# Altium schematic sheet 12V_SUPPLY.SchDoc
size A2; SheetNumber: 2; SheetTotal: 3
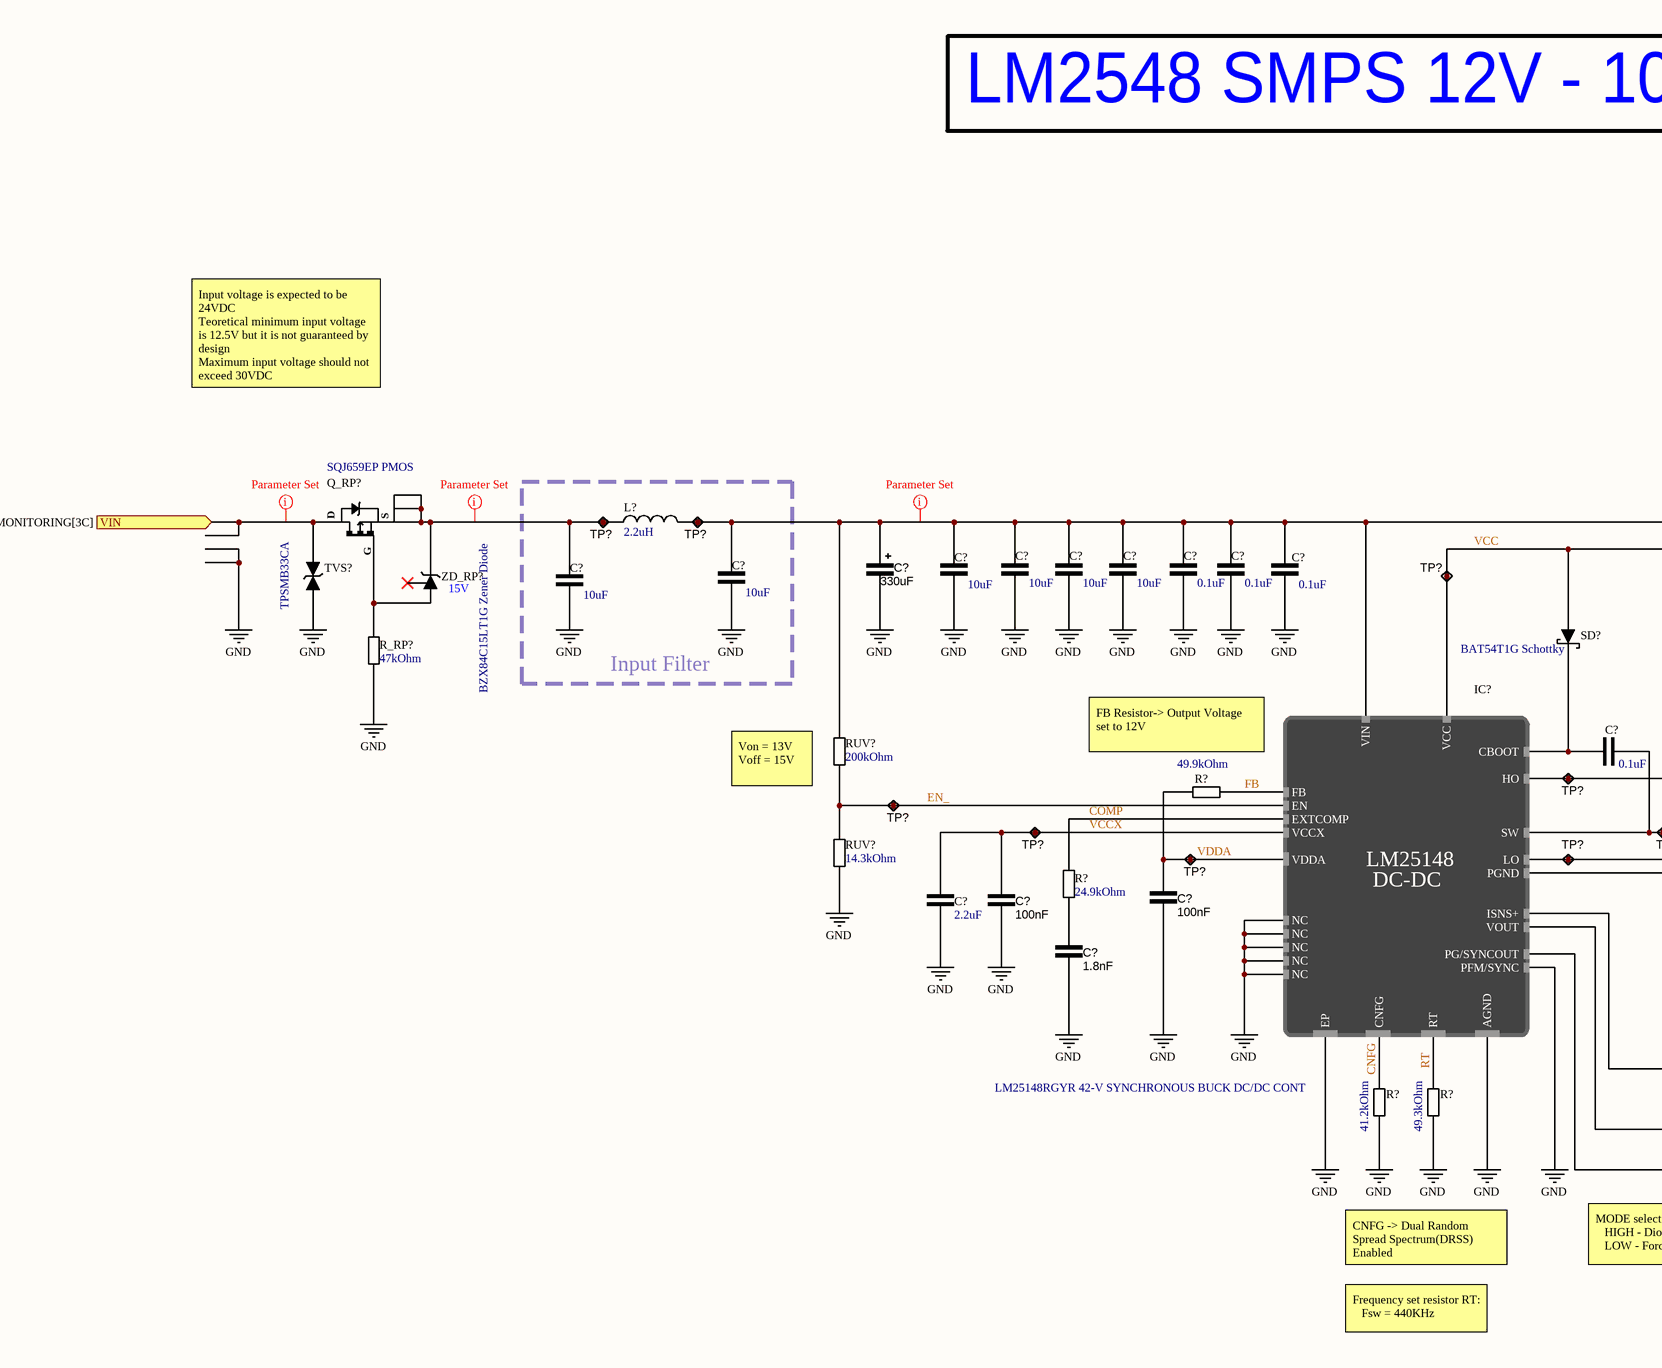
[diagram p0: 12V_SUPPLY.SchDoc, left]
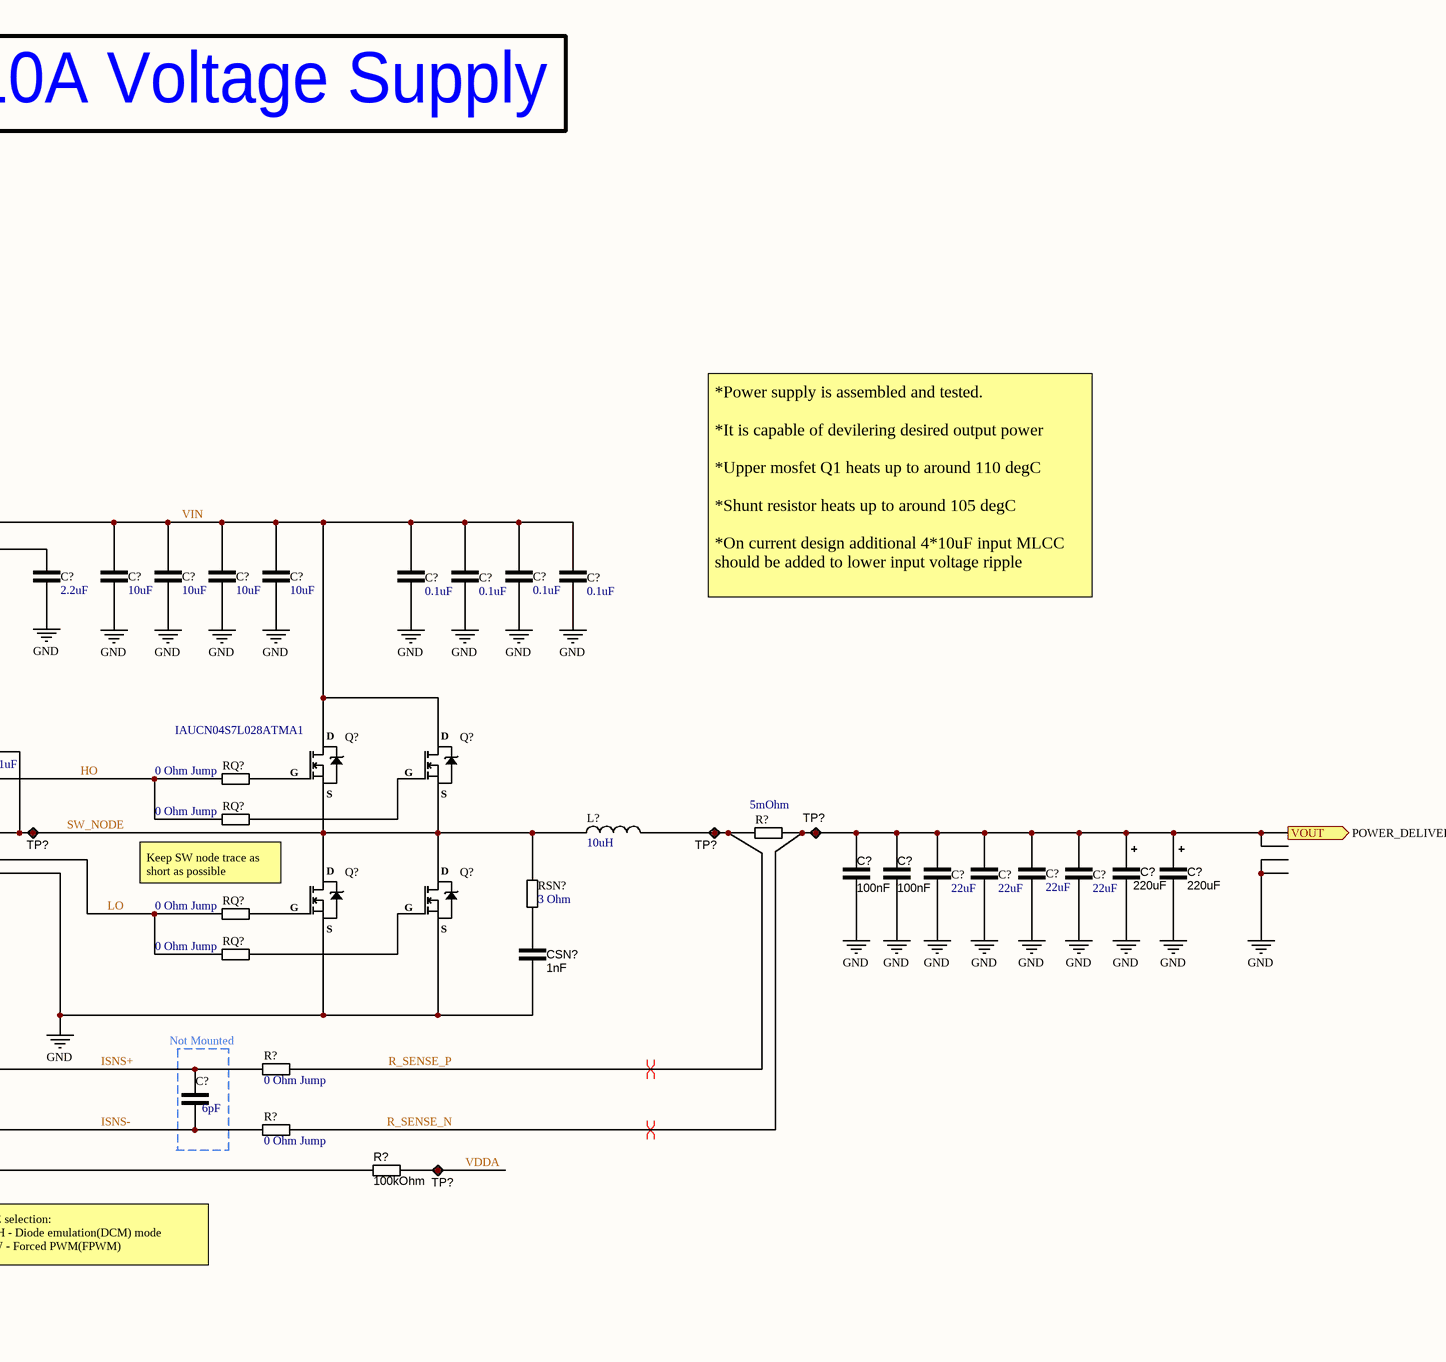
[diagram p1: 12V_SUPPLY.SchDoc, right]

## Parts
(Parts that share a designator on the sheet are numbered #1, #2 ... from top to bottom, then left to right.)
C?#1  330uF  [CAPAE109103X103M]
C?#2  10uF  [CAP_1206]
C?#3  10uF  [CAP_1206]
C?#4  10uF  [CAP_1206]
C?#5  10uF  [CAP_1206]
C?#6  0.1uF  [CAP_0603]
C?#7  0.1uF  [CAP_0603]
C?#8  0.1uF  [CAP_0603]
C?#9  10uF  [CAP_1206]
C?#10  2.2uF  [CAP_0603]
C?#11  10uF  [CAP_1206]
C?#12  10uF  [CAP_1206]
C?#13  10uF  [CAP_1206]
C?#14  10uF  [CAP_1206]
C?#15  0.1uF  [CAP_0603]
C?#16  0.1uF  [CAP_0603]
C?#17  0.1uF  [CAP_0603]
C?#18  0.1uF  [CAP_0603]
C?#19  10uF  [CAP_1206]
C?#20  0.1uF  [CAP_0603]
C?#21  100nF  [CAP_0603]
C?#22  100nF  [CAP_0603]
C?#23  22uF  [CAP_1210]
C?#24  22uF  [CAP_1210]
C?#25  22uF  [CAP_1210]
C?#26  22uF  [CAP_1210]
C?#27  220uF  [CAPAE109103X103M]
C?#28  220uF  [CAPAE109103X103M]
C?#29  2.2uF  [CAP_0603]
C?#30  100nF  [CAP_0603]
C?#31  100nF  [CAP_0603]
C?#32  1.8nF  [CAP_0603]
C?#33  6pF  [CAP_0402]
CSN?  1nF  [CAP_0805]
IC?  LM25148RGYR 42-V SYNCHRONOUS BUCK DC/DC CONT  [VQFN25_RGY_TEX]
L?#1  2.2uH  [IHLP-3232DZ-51]
L?#2  10uH  [INDP135126X65N]
Q?#1  IAUCN04S7L028ATMA1  [PG-TDSON-8-33]
Q?#2  IAUCN04S7L028ATMA1  [PG-TDSON-8-33]  (value not drawn)
Q?#3  IAUCN04S7L028ATMA1  [PG-TDSON-8-33]  (value not drawn)
Q?#4  IAUCN04S7L028ATMA1  [PG-TDSON-8-33]  (value not drawn)
Q_RP?  SQJ659EP PMOS  [PowerPAK SO-8L SINGLE]
R?#1  49.9kOhm  [RES_0603]
R?#2  5mOhm  [SENSE_RES_2512]
R?#3  24.9kOhm  [RES_0603]
R?#4  0 Ohm Jump  [RES_0402]
R?#5  41.2kOhm  [RES_0603]
R?#6  49.3kOhm  [RES_0603]
R?#7  0 Ohm Jump  [RES_0402]
R?#8  100kOhm  [RES_0603]
R_RP?  47kOhm  [RES_0603]
RQ?#1  0 Ohm Jump  [RES_0402]
RQ?#2  0 Ohm Jump  [RES_0402]
RQ?#3  0 Ohm Jump  [RES_0402]
RQ?#4  0 Ohm Jump  [RES_0402]
RSN?  3 Ohm  [RES_0805]
RUV?#1  200kOhm  [RES_0603]
RUV?#2  14.3kOhm  [RES_0603]
SD?  BAT54T1G Schottky  [SODFL371X135-2N]
TP?#1  Test point  [TestPoint]  (value not drawn)  (no BOM)
TP?#2  Test point  [TestPoint]  (value not drawn)  (no BOM)
TP?#3  Test point  [TestPoint]  (value not drawn)  (no BOM)
TP?#4  Test point  [TestPoint]  (value not drawn)  (no BOM)
TP?#5  Test point  [TestPoint]  (value not drawn)  (no BOM)
TP?#6  Test point  [TestPoint]  (value not drawn)  (no BOM)
TP?#7  Test point  [TestPoint]  (value not drawn)  (no BOM)
TP?#8  Test point  [TestPoint]  (value not drawn)  (no BOM)
TP?#9  Test point  [TestPoint]  (value not drawn)  (no BOM)
TP?#10  Test point  [TestPoint]  (value not drawn)  (no BOM)
TP?#11  Test point  [TestPoint]  (value not drawn)  (no BOM)
TP?#12  Test point  [TestPoint]  (value not drawn)  (no BOM)
TVS?  TPSMB33CA  [DO-214AA]
ZD_RP?  BZX84C15LT1G Zener Diode  [SOT95P245X96-3N]

## Blocks framed on the sheet
Input Filter: C?#9 C?#19 L?#1 TP?#1 TP?#2

## Ports
VIN (in, see POWER_DELIVERY_AND_MONITORING[3C]), VOUT (out, see POWER_DELIVERY_AND_MONITORING[4C])

## Nets
GND: C?#1.2 C?#2.1 C?#3.2 C?#4.2 C?#5.2 C?#6.2 C?#7.2 C?#8.1 C?#9.1 C?#10.1 C?#11.2 C?#12.2 C?#13.2 C?#14.2 C?#15.1 C?#16.1 C?#17.2 C?#18.1 C?#19.1 C?#21.1 C?#22.1 C?#23.2 C?#24.2 C?#25.1 C?#26.2 C?#27.2 C?#28.2 C?#29.2 C?#30.1 C?#31.1 C?#32.1 CSN?.1 IC?.1(NC) IC?.2(NC) IC?.7(AGND) IC?.10(PGND) IC?.18(PFM/SYNC) IC?.22(NC) IC?.23(NC) IC?.24(NC) IC?.25(EP) Q?#3.S(Source) Q?#4.S(Source) R?#5.1 R?#6.1 R_RP?.1 RUV?#2.1 TVS?.2(Anode)
CNFG: IC?.3(CNFG) R?#5.2
COMP: IC?.5(EXTCOMP) R?#3.2
EN_: IC?.19(EN) RUV?#1.1 RUV?#2.2 TP?#5.1
FB: IC?.6(FB) R?#1.2
HO: IC?.13(HO) RQ?#1.1 RQ?#2.1 TP?#4.1
ISNS+: C?#33.2 IC?.20(ISNS+) R?#4.1
ISNS-: C?#33.1 IC?.21(VOUT) R?#7.1
LO: IC?.11(LO) RQ?#3.1 RQ?#4.1 TP?#11.1
R_SENSE_N: C?#21.2 C?#22.2 C?#23.1 C?#24.1 C?#25.2 C?#26.1 C?#27.1 C?#28.1 R?#2.2 R?#7.2 TP?#9.1 ; port VOUT
R_SENSE_P: L?#2.2 R?#2.1 R?#4.2 TP?#8.1
RT: IC?.4(RT) R?#6.2
SW_NODE: C?#20.1 IC?.14(SW) L?#2.1 Q?#1.S(Source) Q?#2.S(Source) Q?#3.D(Drain) Q?#4.D(Drain) RSN?.2 TP?#7.1
VCC: C?#10.2 IC?.9(VCC) SD?.1(Anode) TP?#3.1
VCCX: C?#29.1 C?#30.2 IC?.16(VCCX) TP?#6.1
VDDA: C?#31.2 IC?.8(VDDA) R?#1.1 R?#8.2 TP?#10.1 TP?#12.1
VIN: C?#1.1 C?#2.2 C?#3.1 C?#4.1 C?#5.1 C?#6.1 C?#7.1 C?#8.2 C?#9.2 C?#11.1 C?#12.1 C?#13.1 C?#14.1 C?#15.2 C?#16.2 C?#17.1 C?#18.2 IC?.12(VIN) L?#1.2 Q?#1.D(Drain) Q?#2.D(Drain) RUV?#1.2 TP?#2.1
VIN: Q_RP?.D TVS?.1(Cathode) ; port VIN  [a separate net that carries the same name]
NetC?#19_2: C?#19.2 L?#1.1 Q_RP?.S(S1) TP?#1.1 ZD_RP?.3(Cathode)
NetC?#20_2: C?#20.2 IC?.15(CBOOT) SD?.2(Cathode)
NetC?#32_2: C?#32.2 R?#3.1
NetCSN?_2: CSN?.2 RSN?.1
NetIC?_17: IC?.17(PG/SYNCOUT) R?#8.1
NetQ?#1_G: Q?#1.G(Gate) RQ?#1.2
NetQ?#2_G: Q?#2.G(Gate) RQ?#2.2
NetQ?#3_G: Q?#3.G(Gate) RQ?#3.2
NetQ?#4_G: Q?#4.G(Gate) RQ?#4.2
NetQ_RP?_G: Q_RP?.G R_RP?.2 ZD_RP?.1(Anode)

Not connected (* = marked no-connect by the designer): ZD_RP? 2(Anode)*

## Layout directives
differential pair: R_SENSE_N, R_SENSE_P
rule Clearance Constraint [Clearance = 20mil]: NetC?#19_2, VIN
rule Clearance Constraint [Generic clearance = 20mil, and 1 value(s) for objects]: VIN

## Notes on the sheet
- LM2548 SMPS 12V - 10A Voltage Supply
- Input voltage is expected to be 24VDC
  Teoretical minimum input voltage is 12.5V but it is not guaranteed by design
  Maximum input voltage should not exceed 30VDC
- (near ZD_RP?) 15V
- *Power supply is assembled and tested.
  *It is capable of devilering desired output power
  *Upper mosfet Q1 heats up to around 110 degC
  *Shunt resistor heats up to around 105 degC
  *On current design additional 4*10uF input MLCC should be added to lower input voltage ripple
- (near RUV?#1) Von = 13V
  Voff = 15V
- (near IC?) FB Resistor-> Output Voltage set to 12V
- Keep SW node trace as short as possible
- Not Mounted
- CNFG -> Dual Random Spread Spectrum(DRSS) Enabled
- MODE selection:
  HIGH - Diode emulation(DCM) mode
  LOW - Forced PWM(FPWM)
- Frequency set resistor RT:
  Fsw = 440KHz
- (in symbol LM25148RGYR) LM25148; DC-DC

## Library data of the parts
C?#1 = C000026: 330 µF 50 V Aluminum Electrolytic Capacitors Radial, Can - SMD 120mOhm @ 100kHz 2000 Hrs @ 105°C; Manufacturer Product Number: EMZR500ARA331MJA0G; capacitance: 330uF; ComponentLink1Description: DigiKey; ComponentLink1URL: https://www.digikey.com/en/products/detail/chemi-con/EMZR500ARA331MJA0G/5824768; DigiKey Part Number: 565-EMZR500ARA331MJA0GCT-ND
C?#2-C?#5 C?#9 C?#11-C?#14 C?#19 = C000017: 10 µF ±10% 50V Ceramic Capacitor X7R 1206 (3216 Metric); Manufacturer Product Number: CL31B106KBHNNNE; capacitance: 10uF; ComponentLink1Description: DigiKey; ComponentLink1URL: https://www.digikey.com/en/products/detail/samsung-electro-mechanics/CL31B106KBHNNNE/5961251; DigiKey Part Number: 1276-6767-1-ND
C?#6-C?#8 C?#15-C?#18 C?#20 = C000018: 0.1 µF ±10% 50V Ceramic Capacitor X7R 0603 (1608 Metric); Manufacturer Product Number: CL10B104KB8NNNC; capacitance: 0.1uF; ComponentLink1Description: DigiKey; ComponentLink1URL: https://www.digikey.com/en/products/detail/samsung-electro-mechanics/CL10B104KB8NNNC/3886658; DigiKey Part Number: 1276-1000-1-ND
C?#10 C?#29 = C000014: 8 pF ±0.05pF 25V Ceramic Capacitor C0G, NP0 01005 (0402 Metric); Manufacturer Product Number: GRM188C71C225KE11D; ComponentLink1Description: DigiKey; ComponentLink1URL: https://www.digikey.com/en/products/detail/murata-electronics/GRM188C71C225KE11D/4905311; DigiKey Part Number: 490-12731-1-ND; capacitance: 2.2uF
C?#21 C?#22 C?#30 C?#31 = C000007: 0.1 µF ±10% 25V Ceramic Capacitor X7R 0603 (1608 Metric); Manufacturer Product Number: KAM15AR71E104KT; ComponentLink1Description: DigiKey; ComponentLink1URL: https://www.digikey.com/en/products/detail/kyocera-avx/06033C104K4T2A/8019250; capacitance: 100nF; DigiKey Part Number: 478-KAM15AR71E104KTCT-ND
C?#23-C?#26 = C000032: 22 µF ±10% 25V Ceramic Capacitor X7R 1210 (3225 Metric); Manufacturer Product Number: CL32B226KAJNNNE; DigiKey Part Number: 1276-3392-1-ND; ComponentLink1Description: DigiKey; ComponentLink1URL: https://www.digikey.com/en/products/detail/samsung-electro-mechanics/CL32B226KAJNNNE/3889050; capacitance: 22uF
C?#27 C?#28 = C000033: 220 µF 35 V Aluminum - Polymer Capacitors Radial, Can - SMD 23mOhm 1000 Hrs @ 150°C; Manufacturer Product Number: A785MN227M1VLAS023; capacitance: 220uF; ComponentLink1Description: DigiKey; ComponentLink1URL: https://www.digikey.com/en/products/detail/kemet/A785MN227M1VLAS023/22003773?s=N4IgTCBcDaIIIHYAcBWAsgOTGBaCMAagDJwDKADGAMwgC6AvkA; DigiKey Part Number: 399-A785MN227M1VLAS023CT-ND
C?#32 = C000027: 1800 pF ±10% 25V Ceramic Capacitor X7R 0603 (1608 Metric); Manufacturer Product Number: C0603C182K3RACTU; ComponentLink1Description: DigiKey; ComponentLink1URL: https://www.digikey.com/en/products/detail/kemet/C0603C182K3RAC7867/2200107; DigiKey Part Number: 399-15370-1-ND; capacitance: 1.8nF
C?#33 = C000016: 6 pF ±0.5pF 25V Ceramic Capacitor C0G, NP0 0402 (1005 Metric); Manufacturer Product Number: CBR04C609D3GAC; DigiKey Part Number: 399-CBR04C609D3GACCT-ND; ComponentLink1Description: DigiKey; ComponentLink1URL: https://www.digikey.com/en/products/detail/kemet/CBR04C609D3GAC/18137865?s=N4IgjCBcpgLFoDGUBmBDANgZwKYBoQB7KAbXAFYBOAJlgHYQBdAgBwBcoQBlNgJwEsAdgHMQAXwJgAbAhDJI6bPiKkQAZkphyADiasOkbnyGiJIagAZYlWfMW4CxSGSkACFgDE9IdpwCqgvxsAPIoALI4aFgArrw44gQAtNS2UHzRyk5k5ExieUA; capacitance: 6pF
CSN? = C000035: 1000 pF ±10% 100V Ceramic Capacitor X7R 0805 (2012 Metric); Manufacturer Product Number: CC0805KRX7R0BB102; capacitance: 1nF; ComponentLink1Description: DigiKey; ComponentLink1URL: https://www.digikey.com/en/products/detail/yageo/CC0805KRX7R0BB102/2833637; DigiKey Part Number: 311-1472-1-ND
IC? = LM25148RGYR: Buck Regulator Positive Output Step-Down DC-DC Controller IC 24-VQFN (5.5x3.5); DigiKey Part Number: 296-LM25148RGYRCT-ND; Mouser Part Number: 595-LM25148RGYR; ComponentLink1Description: DigiKey; ComponentLink1URL: https://www.digikey.com/en/products/detail/texas-instruments/LM25148RGYR/15857124; ComponentLink2Description: Mouser; ComponentLink2URL: https://eu.mouser.com/ProductDetail/Texas-Instruments/LM25148RGYR?qs=doiCPypUmgEViljGB5jAZw%3D%3D; Manufacturer Product Number: LM25148RGYR
L?#1 = L000015: FIXED IND 2.2UH 11.5A 12.5 MOHM; Manufacturer Product Number: IHLP3232DZER2R2M5A; inductance: 2.2uH; DigiKey Part Number: 541-IHLP3232DZER2R2M5ACT-ND; ComponentLink1Description: DigiKey; ComponentLink1URL: https://www.digikey.com/en/products/detail/vishay-dale/IHLP3232DZER2R2M5A/4070222; case: 3232; Mouser Part Number: 70-IHLP3232DZR2R2M5A; ComponentLink2Description: Mouser; ComponentLink2URL: https://eu.mouser.com/ProductDetail/Vishay-Dale/IHLP3232DZER2R2M5A?qs=tDDpbAIEejr3%252BeiaEh99%252Bg%3D%3D
L?#2 = L000016: FIXED IND 10UH 11A 15.8 MOHM SMD; Manufacturer Product Number: PA4343.103ANLT; inductance: 10uH; DigiKey Part Number: 553-4029-1-ND; ComponentLink1Description: DigiKey; ComponentLink1URL: https://www.digikey.com/en/products/detail/pulse-electronics/PA4343-103ANLT/7943151?s=N4IgTCBcDaIAoEEAsBmVA6AjABhQgcgDIAqIAugL5A; case: 13.5x12.6; Mouser Part Number: 673-PA4343.103ANLT; ComponentLink2Description: Mouser; ComponentLink2URL: https://eu.mouser.com/ProductDetail/Pulse-Electronics/PA4343.103ANLT?qs=chTDxNqvsym%252BWuIQdh7qfw%3D%3D
Q?#1-Q?#4 = 00000014: N-Channel 40 V 100A Surface Mount PG-TDSON-8-33; DigiKey Part Number: 448-IAUCN04S7L028ATMA1CT-ND; Mouser Part Number: 726-IAUCN04S7L028ATM; ComponentLink1Description: DigiKey; ComponentLink1URL: https://www.digikey.com/en/products/detail/infineon-technologies/IAUCN04S7L028ATMA1/22157720?s=N4IgTCBcDaIJIEECqBhAcgBgCwGUDsAMhmABwgC6AvkA; ComponentLink2Description: Mouser; ComponentLink2URL: https://eu.mouser.com/ProductDetail/Infineon-Technologies/IAUCN04S7L028ATMA1?qs=mELouGlnn3deeHozE86VbA%3D%3D; ComponentLink3Description: Footprint Drawing; ComponentLink3URL: https://www.infineon.com/cms/en/product/packages/PG-TDSON/PG-TDSON-8-33/; Manufacturer Product Number: IAUCN04S7L028ATMA1
Q_RP? = 00000005: P-Channel 60 V 52A (Tc) 83W (Tc) Surface Mount PowerPAK® SO-8; Manufacturer Product Number: SQJ459EP-T1_GE3; DigiKey Part Number: SQJ459EP-T1_GE3CT-ND; Mouser Part Number: 78-SQJ459EP-T2_BE3; ComponentLink1Description: DigiKey; ComponentLink1URL: https://www.digikey.com/en/products/detail/vishay-siliconix/SQJ459EP-T1-GE3/6708881; ComponentLink2Description: Mouser; ComponentLink2URL: https://eu.mouser.com/ProductDetail/Vishay-Siliconix/SQJ459EP-T2_BE3?qs=CiayqK2gdcKpg8h0vLRPjA%3D%3D
R?#1 = R000025: 49.9 kOhms ±1% 0.1W, 1/10W Chip Resistor 0603 (1608 Metric) Moisture Resistant Thick Film; Manufacturer Product Number: CRCW060349K9FKEA; ComponentLink1Description: DigiKey; ComponentLink1URL: https://www.digikey.com/en/products/detail/vishay-dale/CRCW060349K9FKEA/1180003; resistance: 49.9kOhm; DigiKey Part Number: 541-49.9KHCT-ND
R?#2 = R000033: 5 mOhms ±1% 2W Chip Resistor 2512 (6332 Metric) Automotive AEC-Q200, Current Sense, Moisture Resistant Metal Element; Manufacturer Product Number: CRF2512-FZ-R005ELF; ComponentLink1Description: DigiKey; ComponentLink1URL: https://www.digikey.com/en/products/detail/bourns-inc/CRF2512-FZ-R005ELF/6210986; resistance: 5mOhm; DigiKey Part Number: CRF2512-FZ-R005ELFCT-ND
R?#3 = R000017: 24.9 kOhms ±1% 0.1W, 1/10W Chip Resistor 0603 (1608 Metric) Automotive AEC-Q200 Thick Film; Manufacturer Product Number: ERJ-3EKF2492V; ComponentLink1Description: DigiKey; ComponentLink1URL: https://www.digikey.com/en/products/detail/panasonic-electronic-components/ERJ-3EKF2492V/196236; resistance: 24.9kOhm; DigiKey Part Number: P24.9KHCT-ND
R?#4 R?#7 RQ?#1-RQ?#4 = R000008: 0 Ohms Jumper Chip Resistor 0402 (1005 Metric) Automotive AEC-Q200 Thick Film; Manufacturer Product Number: ERJ-2GE0R00X; resistance: 0 Ohm Jump; DigiKey Part Number: P0.0JCT-ND; ComponentLink1Description: DigiKey; ComponentLink1URL: https://www.digikey.com/en/products/detail/panasonic-electronic-components/ERJ-2GE0R00X/146727
R?#5 = R000015: 41.2 kOhms ±1% 0.1W, 1/10W Chip Resistor 0603 (1608 Metric) Automotive AEC-Q200 Thick Film; Manufacturer Product Number: ERJ-3EKF4122V; ComponentLink1Description: DigiKey; ComponentLink1URL: https://www.digikey.com/en/products/detail/panasonic-electronic-components/ERJ-3EKF4122V/196347; resistance: 41.2kOhm; DigiKey Part Number: P41.2KHCT-ND
R?#6 = R000023: 49.3 kOhms ±0.1% 0.1W, 1/10W Chip Resistor 0603 (1608 Metric) Thin Film; Manufacturer Product Number: RT0603BRD0749K3L; ComponentLink1Description: DigiKey; ComponentLink1URL: https://www.digikey.com/en/products/detail/yageo/RT0603BRD0749K3L/5927964; resistance: 49.3kOhm; DigiKey Part Number: 13-RT0603BRD0749K3LCT-ND
R?#8 = R000006: 100 kOhms ±1% 0.1W, 1/10W Chip Resistor 0603 (1608 Metric) Automotive AEC-Q200 Thick Film; Manufacturer Product Number: RMCF0603FG100K; resistance: 100kOhm; ComponentLink1Description: DigiKey; ComponentLink1URL: https://www.digikey.com/en/products/detail/stackpole-electronics-inc/RMCF0603FG100K/1713543; DigiKey Part Number: RMCF0603FG100KCT-ND
R_RP? = R000010: 47 kOhms ±1% 0.1W, 1/10W Chip Resistor 0603 (1608 Metric) Moisture Resistant Thick Film; Manufacturer Product Number: RC0603FR-0747KL; ComponentLink1Description: DigiKey; ComponentLink1URL: https://www.digikey.com/en/products/detail/yageo/RC0603FR-0747KL/727253; resistance: 47kOhm; DigiKey Part Number: 311-47.0KHRCT-ND
RSN? = R000034: 3 Ohms ±1% 0.125W, 1/8W Chip Resistor 0805 (2012 Metric) Moisture Resistant Thick Film; Manufacturer Product Number: RC0805FR-073RL; ComponentLink1Description: DigiKey; ComponentLink1URL: https://www.digikey.com/en/products/detail/yageo/RC0805FR-073RL/727799; resistance: 3 Ohm; DigiKey Part Number: 311-3.00CRCT-ND
RUV?#1 = R000031: 200 kOhms ±1% 0.1W, 1/10W Chip Resistor 0603 (1608 Metric) Moisture Resistant Thick Film; Manufacturer Product Number: RC0603FR-07200KL; ComponentLink1Description: DigiKey; ComponentLink1URL: https://www.digikey.com/en/products/detail/yageo/RC0603FR-07200KL/727044; resistance: 200kOhm; DigiKey Part Number: 311-200KHRCT-ND
RUV?#2 = R000032: 14.3 kOhms ±1% 0.1W, 1/10W Chip Resistor 0603 (1608 Metric) Automotive AEC-Q200 Thick Film; Manufacturer Product Number: RMCF0603FT14K3; ComponentLink1Description: DigiKey; ComponentLink1URL: https://www.digikey.com/en/products/detail/stackpole-electronics-inc/RMCF0603FT14K3/1761296; resistance: 14.3kOhm; DigiKey Part Number: RMCF0603FT14K3CT-ND
SD? = 00000009: Diode 30 V 200mA Surface Mount SOD-123; DigiKey Part Number: BAT54T1GOSCT-ND; ComponentLink1Description: DigiKey; ComponentLink1URL: https://www.digikey.com/en/products/detail/onsemi/BAT54T1G/918319; Manufacturer Product Number: BAT54T1G
TP?#1-TP?#12 = TP002: Test point 1mm
TVS? = 00000015: 45.7V Clamp 13.3A Ipp Tvs Diode Surface Mount DO-214AA (SMBJ); DigiKey Part Number: F6323CT-ND; ComponentLink1Description: DigiKey; ComponentLink1URL: https://www.digikey.com/en/products/detail/littelfuse-inc/TPSMB33CA/4835275; Manufacturer Product Number: TPSMB33CA
ZD_RP? = 00000016: Zener Diode 15 V 250 mW ±6% Surface Mount SOT-23-3 (TO-236); DigiKey Part Number: BZX84C15LT1GOSCT-ND; ComponentLink1Description: DigiKey; ComponentLink1URL: https://www.digikey.com/en/products/detail/onsemi/BZX84C15LT1G/918390; Manufacturer Product Number: BZX84C15LT1G; JLCPCB Part Number: C80857